# EAGLE design fuzebox (EAGLE 4.13)
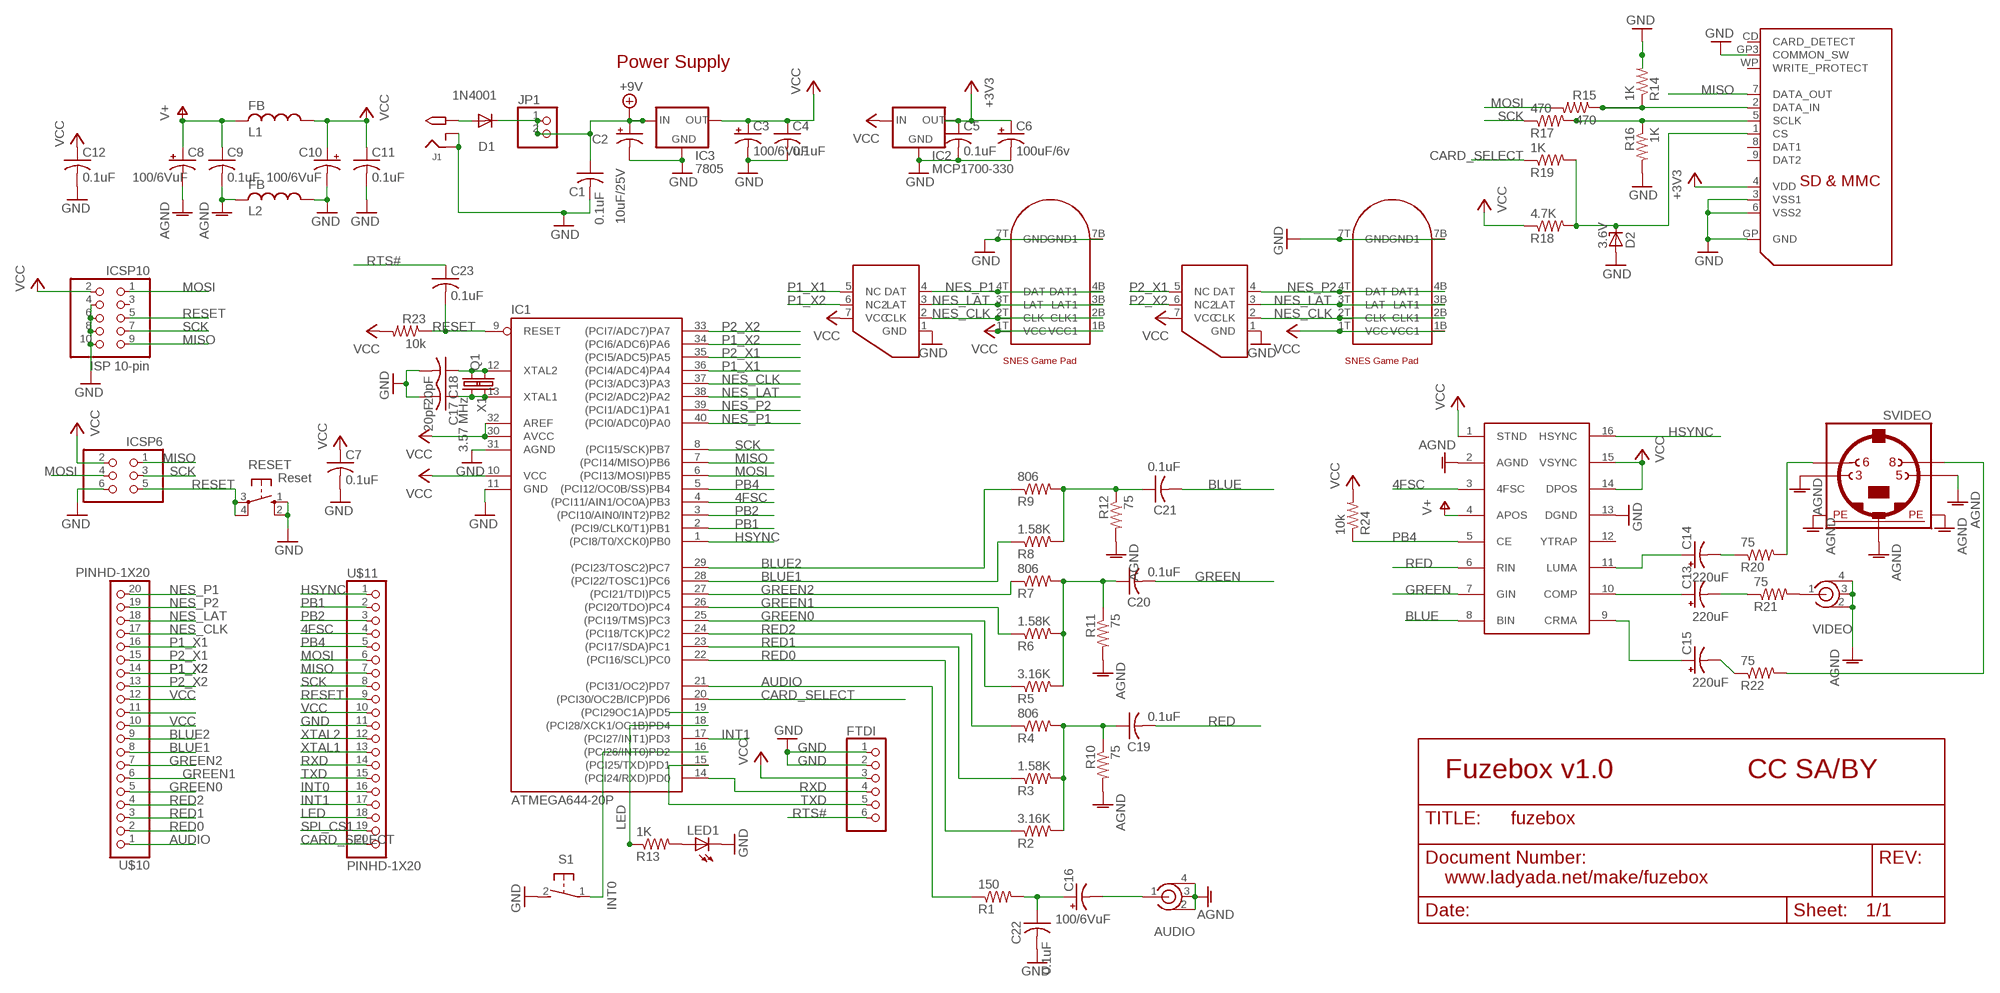
[diagram p0: schematic, sheet 1]

## Parts
AUDIO  RCA-JACK  [RJC-014]
C1  0.1uF  C-US025-025X050  [C025-025X050]
C2  10uF/25V  CPOL-USE2.5-5  [E2,5-5]
C3  100/6VuF  CPOL-USE2.5-6  [E2,5-6]
C4  0.1uF  C-US025-025X050  [C025-025X050]
C5  0.1uF  C-US025-025X050  [C025-025X050]
C6  100uF/6v  CPOL-USE2.5-5  [E2,5-5]
C7  0.1uF  C-US025-025X050  [C025-025X050]
C8  100/6VuF  CPOL-USE2.5-6  [E2,5-6]
C9  0.1uF  C-US025-025X050  [C025-025X050]
C10  100/6VuF  CPOL-USE2.5-5  [E2,5-5]
C11  0.1uF  C-US025-025X050  [C025-025X050]
C12  0.1uF  C-US025-025X050  [C025-025X050]
C13  220uF  CPOL-USE2.5-6  [E2,5-6]
C14  220uF  CPOL-USE2.5-6  [E2,5-6]
C15  220uF  CPOL-USE2.5-6  [E2,5-6]
C16  100/6VuF  CPOL-USE2.5-6  [E2,5-6]
C17  20pF  C-US025-025X050  [C025-025X050]
C18  20pF  C-US025-025X050  [C025-025X050]
C19  0.1uF  C-US025-025X050  [C025-025X050]
C20  0.1uF  C-US025-025X050  [C025-025X050]
C21  0.1uF  C-US025-025X050  [C025-025X050]
C22  0.1uF  C-US025-025X050  [C025-025X050]
C23  0.1uF  C-US025-025X050  [C025-025X050]
D1  1N4001  1N4004  [DO41-10]
D2  3.6V  ZENER-DIODEDO35Z10  [DO35Z10]
FTDI  PINHD-1X6CLEAN  [1X06-CLEAN]
IC1  ATMEGA644-20P  [DIL40]
IC2  MCP1700-330  MC1700  [TO92]
IC3  7805  78XXL  [78XXL]
IC4  AD725  [SO16W]
ICSP6  PINHD-2X3  [2X03]
ICSP10  ISP 10-pin  PINHD-2X5  [2X05]
J1  2.1MMJACK  [PJ-102A]
JP1  PINHD-1X2  [1X02]
L1  FB  [FB]
L2  FB  [FB]
LED1  LED3MM  [LED3MM]
P1  SNES  [SNES]
P1'  NES  [NES]
P2  SNES  [SNES]
P2'  NES  [NES]
Q1  CRYTALTC38H  [TC38H]
R1  150  R-US_0207/10  [0207/10]
R2  3.16K  R-US_0207/5V  [0207/5V]
R3  1.58K  R-US_0207/5V  [0207/5V]
R4  806  R-US_0207/5V  [0207/5V]
R5  3.16K  R-US_0207/5V  [0207/5V]
R6  1.58K  R-US_0207/5V  [0207/5V]
R7  806  R-US_0207/5V  [0207/5V]
R8  1.58K  R-US_0207/5V  [0207/5V]
R9  806  R-US_0207/5V  [0207/5V]
R10  75  R-US_0207/5V  [0207/5V]
R11  75  R-US_0207/5V  [0207/5V]
R12  75  R-US_0207/5V  [0207/5V]
R13  1K  R-US_0207/10  [0207/10]
R14  1K  R-US_0207/10  [0207/10]
R15  470  R-US_0207/10  [0207/10]
R16  1K  R-US_0207/10  [0207/10]
R17  470  R-US_0207/10  [0207/10]
R18  4.7K  R-US_0207/10  [0207/10]
R19  1K  R-US_0207/10  [0207/10]
R20  75  R-US_0207/5V  [0207/5V]
R21  75  R-US_0207/5V  [0207/5V]
R22  75  R-US_0207/5V  [0207/5V]
R23  10k  R-US_0207/10  [0207/10]
R24  10k  R-US_0207/5V  [0207/5V]
RESET  Reset  10-XX  [B3F-10XX]
S1  31-XX  [B3F-31XX]
SVIDEO  MINI_DIN_4  [M_DIN4]
U$10  PINHD-1X20  [1X10-BIG]
U$11  PINHD-1X20  [1X10-BIG]
VIDEO  RCA-JACK  [RJC-014]
X1  3.57 MHz  CRYSTAL  [HC49]
X2  SDMMC06132  [06132]

## Nets
4FSC: IC1.4((PCI11/AIN1/OC0A)PB3) IC4.3(4FSC) U$11.4
+3V3: C5.1 C6.+ IC2.3(OUT) X2.4(VDD)
+9V: C1.1 C2.+ D1.C IC3.IN JP1.1 JP1.2
AGND: AUDIO.2(GND1) AUDIO.3(GND2) AUDIO.4(GND3) C8.- C9.2 IC4.2(AGND) L2.P$2 R10.2 R11.2 R12.2 SVIDEO.3 SVIDEO.5 SVIDEO.SH1(PE1) SVIDEO.SH2(PE2) SVIDEO.SH3(PE3) VIDEO.2(GND1) VIDEO.3(GND2) VIDEO.4(GND3)
AUDIO: IC1.21((PCI31/OC2)PD7) R1.1 U$10.1
BLUE: C21.2 IC4.8(BIN)
BLUE1: IC1.28((PCI22/TOSC1)PC6) R8.1 U$10.8
BLUE2: IC1.29((PCI23/TOSC2)PC7) R9.1 U$10.9
CARD_SELECT: IC1.20((PCI30/OC2B/ICP)PD6) R19.1 U$11.20
GND: C1.2 C2.- C3.- C4.2 C5.2 C6.- C7.2 C10.- C11.2 C12.2 C17.2 C18.2 C22.2 D2.A FTDI.1 FTDI.2 IC1.11(GND) IC1.31(AGND) IC2.1(GND) IC3.GND IC4.13(DGND) ICSP6.6 ICSP10.4 ICSP10.6 ICSP10.8 ICSP10.10 J1.RING J1.RING_SW L2.P$1 LED1.K(C) P1'.1(GND) P1.7B(GND1) P1.7T(GND) P2'.1(GND) P2.7B(GND1) P2.7T(GND) R14.2 R16.2 RESET.1(S) RESET.2(S1) S1.2(S) U$10.11 U$11.11 X2.3(VSS1) X2.6(VSS2) X2.GP3(COMMON_SW) X2.GP(GND)
GREEN: C20.2 IC4.7(GIN)
GREEN0: IC1.25((PCI19/TMS)PC3) R5.1 U$10.5
GREEN1: IC1.26((PCI20/TDO)PC4) R6.1 U$10.6
GREEN2: IC1.27((PCI21/TDI)PC5) R7.1 U$10.7
HSYNC: IC1.1((PCI8/T0/XCK0)PB0) IC4.16(HSYNC) U$11.1
INT0: IC1.16((PCI26/INT0)PD2) S1.1(P) U$11.16
INT1: IC1.17((PCI27/INT1)PD3) U$11.17
LED: IC1.18((PCI28/XCK1/OC1B)PD4) R13.1 U$11.18
MISO: IC1.7((PCI14/MISO)PB6) ICSP6.1 ICSP10.9 U$11.7 X2.7(DATA_OUT)
MOSI: IC1.6((PCI13/MOSI)PB5) ICSP6.4 ICSP10.1 R15.2 U$11.6
N$2: IC1.19((PCI29OC1A)PD5)
N$13: LED1.A R13.2
N$14: C19.1 R2.2 R3.2 R4.2 R10.1
N$16: C20.1 R5.2 R6.2 R7.2 R11.1
N$17: D1.A J1.TIP
N$20: C21.1 R8.2 R9.2 R12.1
N$22: C13.+ IC4.10(COMP)
N$23: C13.- R21.1
N$24: R21.2 VIDEO.1(SIG)
N$26: C16.+ C22.1 R1.2
N$27: AUDIO.1(SIG) C16.-
N$29: R20.2 SVIDEO.6
N$30: R22.2 SVIDEO.8
N$31: C15.- R22.1
N$32: C15.+ IC4.9(CRMA)
N$33: C14.+ IC4.11(LUMA)
N$34: C14.- R20.1
N$46: R14.1 R15.1 X2.2(DATA_IN)
N$47: R16.1 R17.2 X2.5(SCLK)
N$48: D2.C R18.2 R19.2 X2.1(CS)
NES_CLK: IC1.37((PCI3/ADC3)PA3) P1'.2(CLK) P1.2B(CLK1) P1.2T(CLK) P2'.2(CLK) P2.2B(CLK1) P2.2T(CLK) U$10.17
NES_LAT: IC1.38((PCI2/ADC2)PA2) P1'.3(LAT) P1.3B(LAT1) P1.3T(LAT) P2'.3(LAT) P2.3B(LAT1) P2.3T(LAT) U$10.18
NES_P1: IC1.40((PCI0/ADC0)PA0) P1'.4(DAT) P1.4B(DAT1) P1.4T(DAT) U$10.20
NES_P2: IC1.39((PCI1/ADC1)PA1) P2'.4(DAT) P2.4B(DAT1) P2.4T(DAT) U$10.19
P1_X1: IC1.36((PCI4/ADC4)PA4) P1'.5(NC) U$10.16
P1_X2: IC1.34((PCI6/ADC6)PA6) P1'.6(NC2) U$10.14
P2_X1: IC1.35((PCI5/ADC5)PA5) P2'.5(NC) U$10.15
P2_X2: IC1.33((PCI7/ADC7)PA7) P2'.6(NC2) U$10.13
PB1: IC1.2((PCI9/CLK0/T1)PB1) U$11.2
PB2: IC1.3((PCI10/AIN0/INT2)PB2) U$11.3
PB4: IC1.5((PCI12/OC0B/SS)PB4) IC4.5(CE) R24.1 U$11.5
RED: C19.2 IC4.6(RIN)
RED0: IC1.22((PCI16/SCL)PC0) R2.1 U$10.2
RED1: IC1.23((PCI17/SDA)PC1) R3.1 U$10.3
RED2: IC1.24((PCI18/TCK)PC2) R4.1 U$10.4
RESET: C23.2 IC1.9(RESET) ICSP6.5 ICSP10.5 R23.1 RESET.3(P) RESET.4(P1) U$11.9
RTS#: C23.1 FTDI.6
RXD: FTDI.4 IC1.14((PCI24/RXD)PD0) U$11.14
SCK: IC1.8((PCI15/SCK)PB7) ICSP6.3 ICSP10.7 R17.1 U$11.8
SPI_CS1: U$11.19
TXD: FTDI.5 IC1.15((PCI25/TXD)PD1) U$11.15
V+: C8.+ C9.1 IC4.4(APOS) L1.P$2
VCC: C3.+ C4.1 C7.1 C10.+ C11.1 C12.1 FTDI.3 IC1.10(VCC) IC1.30(AVCC) IC1.32(AREF) IC2.2(IN) IC3.OUT IC4.1(STND) IC4.14(DPOS) IC4.15(VSYNC) ICSP6.2 ICSP10.2 L1.P$1 P1'.7(VCC) P1.1B(VCC1) P1.1T(VCC) P2'.7(VCC) P2.1B(VCC1) P2.1T(VCC) R18.1 R23.2 R24.2 U$10.10 U$10.12 U$11.10
XTAL1: C17.1 IC1.13(XTAL1) Q1.1 U$11.13 X1.2
XTAL2: C18.1 IC1.12(XTAL2) Q1.2 U$11.12 X1.1
Unconnected: IC4.12(YTRAP) ICSP10.3 X2.8(DAT1) X2.9(DAT2) X2.CD(CARD_DETECT) X2.WP(WRITE_PROTECT)

## Notes on the sheet
- Power Supply
- Fuzebox v1.0 | CC SA/BY
- www.ladyada.net/make/fuzebox

## Library data of the parts
AUDIO VIDEO = ybox2:RCA-JACK
C1 C4 C7 C9 C11 C12 C19-C23 = minimidi:C-US: CAPACITOR, American symbol
C2 C3 C8 C10 C13-C16 = minimidi:CPOL-US: POLARIZED CAPACITOR, American symbol
C5 C17 C18 = rcl-ez:C-US: CAPACITOR, American symbol
C6 = rcl-ez:CPOL-US: POLARIZED CAPACITOR, American symbol
D1 = minimidi:1N4004: DIODE general purpose rectifier, 1 A
D2 = diode:ZENER-DIODE: Z-Diode
FTDI = carduino:PINHD-1X6: PIN HEADER
IC1 = avr:ATMEGA644*P: MICROCONTROLLER 64 kBytes FLASH 4 kBytes SRAM 2 kBytes EEPROM DUAL USART 8-channel 10 bit ADC
IC2 = ulink:MC1700: VOLTAGE REGULATOR
IC3 = v-reg:78XXL: VOLTAGE REGULATOR
IC4 = ad725:AD725
ICSP6 = pinhead:PINHD-2X3: PIN HEADER
ICSP10 = sonar:PINHD-2X5: PIN HEADER
J1 = minimidi:2.1MMJACK
JP1 = pinhead:PINHD-1X2: PIN HEADER
L1 L2 = ybox2:FB
LED1 = led-ez:LED: LED OSRAM: - CHIPLED LG R971, LG N971, LY N971, LG Q971, LY Q971, LO R971, LY R971 LH N974, LH R974 LS Q976, LO Q976, LY Q976 LO Q996 - Hyper CHIPLED LW Q18S LB Q993, LB Q99A, LB R99A - SideLED LS A670, LO A670, LY A670, LG A670, LP A670 LB A673, LV A673, LT A673, LW A673 LH A674 LY A675 LS A676, LA A676, LO A676, LY A676, LW A676 LS A679, LY A679, LG A679 - Hyper Micro SIDELED® LS Y876, LA Y876, LO Y876, LY Y876 LT Y87S - SmartLED LW L88C, LW L88S LB L89C, LB L89S, LG L890 LS L89K, LO L89K, LY L89K LS L896, LA L896, LO L896, LY L896 - TOPLED LS T670, LO T670, LY T670, LG T670, LP T670 LSG T670, LSP T670, LSY T670, LOP T670, LYG T670 LG T671, LOG T671, LSG T671 LB T673, LV T673, LT T673, LW T673 LH T674 LS T676, LA T676, LO T676, LY T676, LB T676, LH T676, LSB T676, LW T676 LB T67C, LV T67C, LT T67C, LS T67K, LO T67K, LY T67K, LW E67C LS E67B, LA E67B, LO E67B, LY E67B, LB E67C, LV E67C, LT E67C LW T67C LS T679, LY T679, LG T679 LS T770, LO T770, LY T770, LG T770, LP T770 LB T773, LV T773, LT T773, LW T773 LH T774 LS E675, LA E675, LY E675, LS T675 LS T776, LA T776, LO T776, LY T776, LB T776 LHGB T686 LT T68C, LB T68C - Hyper Mini TOPLED® LB M676 - Mini TOPLED Santana® LG M470 LS M47K, LO M47K, LY M47K Source: http://www.osram.convergy.de/
P1 P2 = gameconnectors:SNES
P1' P2' = gameconnectors:NES
Q1 = crystal:CRYTAL: CRYSTAL
R1-R24 = rcl-ez:R-US_: RESISTOR, American symbol
RESET = switch-omron:10-XX: OMRON SWITCH
S1 = switch-omron:31-XX: OMRON SWITCH
SVIDEO = mini_din:MINI_DIN_4
U$10 U$11 = gameconnectors:PINHD-1X20
X1 = sim:CRYSTAL
X2 = ashield:SDMMC

## Board
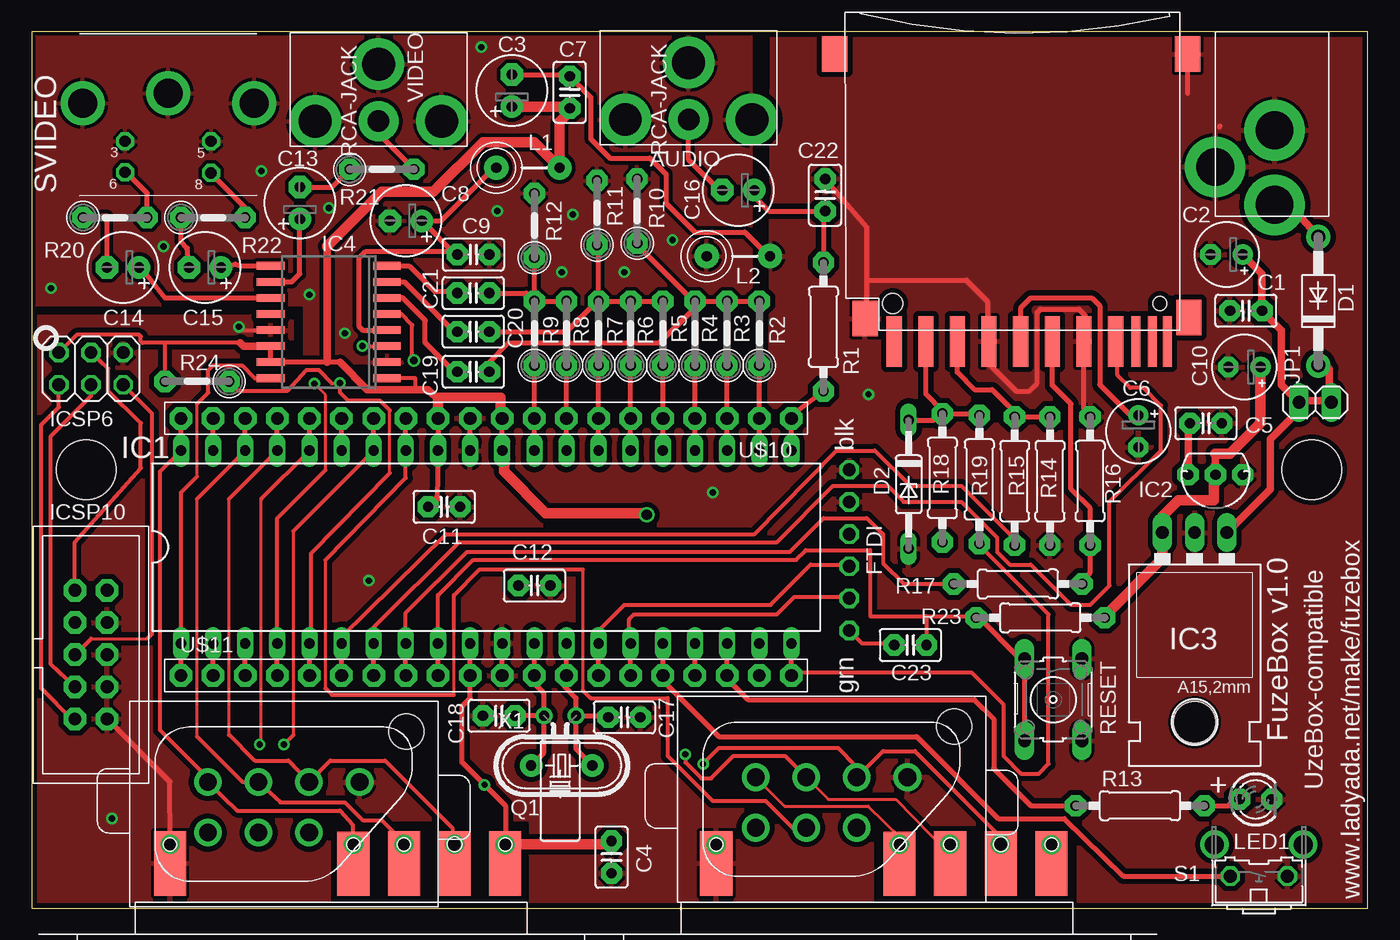
[diagram p1: board, top side]
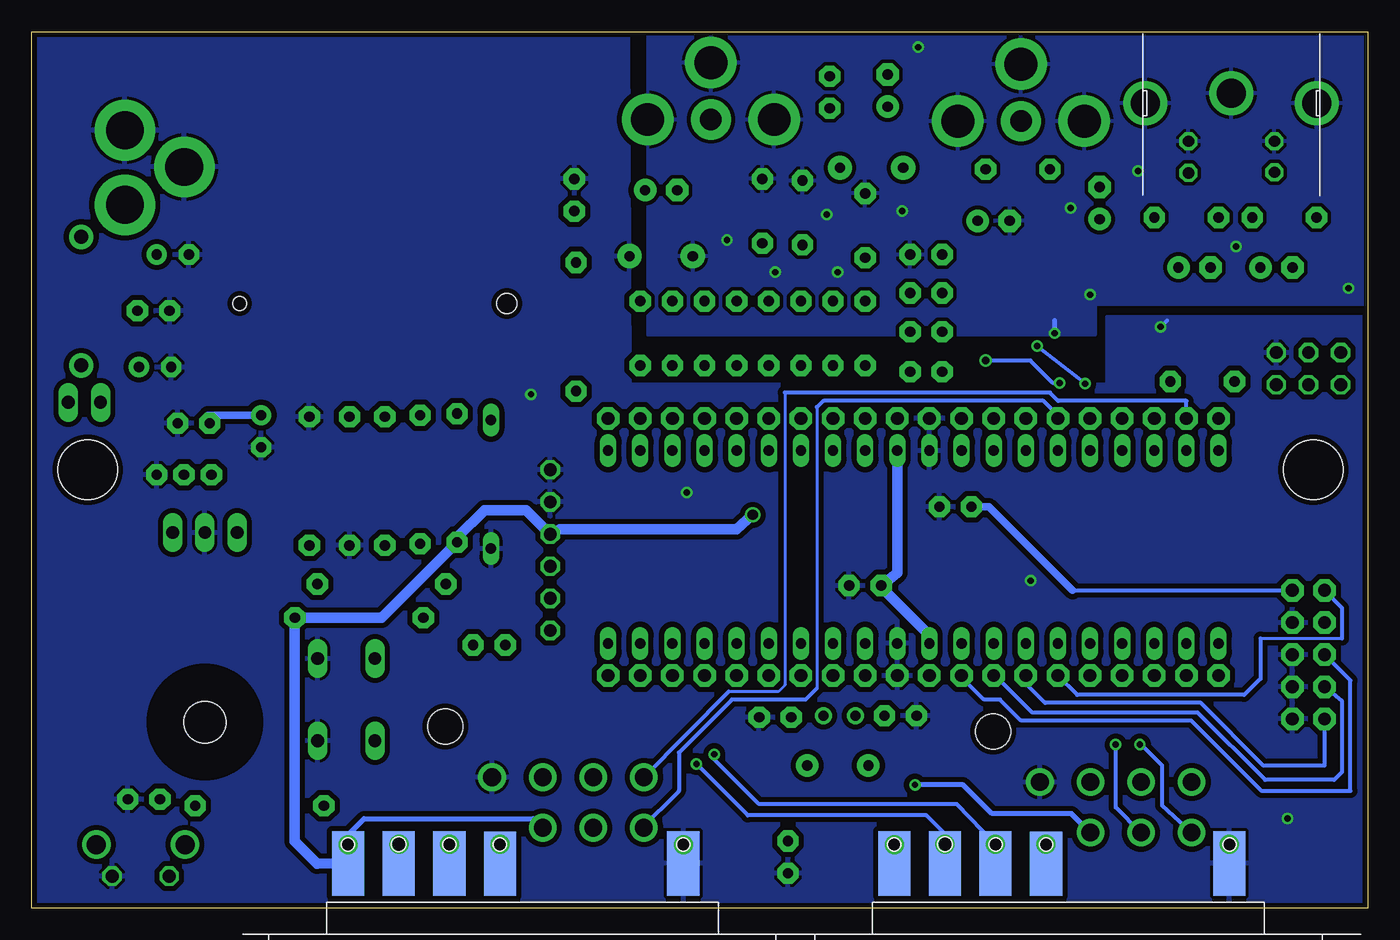
[diagram p2: board, bottom side, seen from below]

Size 105.64 x 69.27 mm. Coordinates in mm from the lower left corner, seen from the top.
Outline: 0,0 105.64,0 105.64,69.27 0,69.27 0,0
Copper layers (1*16): Top 0.035mm / dielectric 1.5mm / Bottom 0.035mm
Design rules "default": minimum track width 10mil, minimum drill 19mil, track to track 10mil, track to pad 10mil, pad to pad 10mil, via to via 10mil, smd to smd 0mil, copper to edge 10mil, drill to drill 8mil, minimum pad ring 10mil, minimum via ring 8mil, stop-mask expansion 4mil, vias tented up to drill 0mil, thermal gap 10mil
Holes 4.7 mm at 4.31,34.63 101.21,34.63

### Footprints (pad centres in the part's own frame; a part is rotated, then mirrored left to right if it is on the bottom)
RJC-014 = drill 1.7 pad 3.175 round: 1 0,0 | drill 2.6 pad 4.064 round: 2 -4.5,0; 3 0,5; 4 0,-5
C025-025X050 = drill 0.813 pad 1.676 octagon: 1 -1.27,0; 2 1.27,0
E2,5-5 = drill 0.813 pad 1.6 round: + -1.27,0 | drill 0.813 pad 1.6 octagon: - 1.27,0
E2,5-6 = drill 0.813 pad 1.778 round: + -1.27,0 | drill 0.813 pad 1.778 octagon: - 1.27,0
DO41-10 = drill 1.118 pad 1.93 round: A 5.08,0; C -5.08,0
DO35Z10 = drill 0.813 long: A 5.08,0; C -5.08,0
1X06-CLEAN = drill 1.016 octagon: 1 -6.35,0; 2 -3.81,0; 3 -1.27,0; 4 1.27,0; 5 3.81,0; 6 6.35,0
DIL40 = drill 0.813 long: 1 -24.13,-7.62; 2 -21.59,-7.62; 3 -19.05,-7.62; 4 -16.51,-7.62; 5 -13.97,-7.62; 6 -11.43,-7.62; 7 -8.89,-7.62; 8 -6.35,-7.62; 9 -3.81,-7.62; 10 -1.27,-7.62; 11 1.27,-7.62; 12 3.81,-7.62; 13 6.35,-7.62; 14 8.89,-7.62; 15 11.43,-7.62; 16 13.97,-7.62; 17 16.51,-7.62; 18 19.05,-7.62; 19 21.59,-7.62; 20 24.13,-7.62; 21 24.13,7.62; 22 21.59,7.62; 23 19.05,7.62; 24 16.51,7.62; 25 13.97,7.62; 26 11.43,7.62; 27 8.89,7.62; 28 6.35,7.62; 29 3.81,7.62; 30 1.27,7.62; 31 -1.27,7.62; 32 -3.81,7.62; 33 -6.35,7.62; 34 -8.89,7.62; 35 -11.43,7.62; 36 -13.97,7.62; 37 -16.51,7.62; 38 -19.05,7.62; 39 -21.59,7.62; 40 -24.13,7.62
TO92 = drill 0.813 pad 1.676 octagon: 1 -2.159,0; 2 0,0; 3 2.159,0
78XXL = drill 1.016 long: GND 0,-3.81; IN -2.54,-3.81; OUT 2.54,-3.81 | hole 3.302: 0,11.176
SO16W = smd 0.6 x 2.2: 1 -4.445,-4.6; 2 -3.175,-4.6; 3 -1.905,-4.6; 4 -0.635,-4.6; 5 0.635,-4.6; 6 1.905,-4.6; 7 3.175,-4.6; 8 4.445,-4.6; 9 4.445,4.6; 10 3.175,4.6; 11 1.905,4.6; 12 0.635,4.6; 13 -0.635,4.6; 14 -1.905,4.6; 15 -3.175,4.6; 16 -4.445,4.6
2X03 = drill 1.016 octagon: 1 -2.54,-1.27; 2 -2.54,1.27; 3 0,-1.27; 4 0,1.27; 5 2.54,-1.27; 6 2.54,1.27
2X05 = drill 1.016 pad 1.778 octagon: 1 -5.08,-1.27; 2 -5.08,1.27; 3 -2.54,-1.27; 4 -2.54,1.27; 5 0,-1.27; 6 0,1.27; 7 2.54,-1.27; 8 2.54,1.27; 9 5.08,-1.27; 10 5.08,1.27
PJ-102A = drill 3 pad 4.8 round: RING 0.1,-3.39; RING_SW -4.6,-6.29; TIP 0.1,-9.29
1X02 = drill 1.016 long: 1 -1.27,0; 2 1.27,0
FB = drill 0.8 pad 1.93 round: P$1 -2.5,0; P$2 2.5,0
LED3MM = drill 0.813 pad 1.676 octagon: A -1.27,0; K 1.27,0
SNES = smd 2.54 x 5.08 bottom: 1B -13.7,5.6; 2B -9.7,5.6; 3B -5.7,5.6; 4B -1.698,5.578; 7B 12.8,5.6 | smd 2.54 x 5.08: 1T -13.7,5.6; 2T -9.7,5.6; 3T -5.7,5.6; 4T -1.698,5.578; 7T 12.8,5.6
NES = drill 1.4 pad 2.184 round: 1 6,2; 2 2,2; 3 -2,2; 4 -6,2; 5 -6,-2; 6 -2,-2; 7 2,-2 | hole 2.8: 9.7,6
TC38H = drill 0.813 round: 1 -1.27,0; 2 1.27,0
0207/10 = drill 0.813 pad 1.676 octagon: 1 -5.08,0; 2 5.08,0
0207/5V = drill 0.813 pad 1.676 octagon: 1 -2.54,0; 2 2.54,0
B3F-10XX = drill 1.016 long: 1 -3.251,2.261; 2 3.251,2.261; 3 -3.251,-2.261; 4 3.251,-2.261
B3F-31XX = drill 1.016 octagon: 1 -2.261,-1.245; 2 2.261,-1.245 | drill 1.499 pad 2.159 round: 3 -3.505,1.245; 4 3.505,1.245
M_DIN4 = drill 0.9 pad 1.422 octagon: 3 -3.4,-3.75; 5 3.4,-3.75; 6 -3.4,-6.2; 8 3.4,-6.25 | drill 2.3 pad 3.5 round: SH1 6.8,-0.75; SH2 0,0.05; SH3 -6.75,-0.75
1X10-BIG = drill 1.016 pad 1.778 octagon: 1 -24.13,0; 2 -21.59,0; 3 -19.05,0; 4 -16.51,0; 5 -13.97,0; 6 -11.43,0; 7 -8.89,0; 8 -6.35,0; 9 -3.81,0; 10 -1.27,0; 11 1.27,0; 12 3.81,0; 13 6.35,0; 14 8.89,0; 15 11.43,0; 16 13.97,0; 17 16.51,0; 18 19.05,0; 19 21.59,0; 20 24.13,0
HC49 = drill 0.813 pad 1.778 round: 1 -2.413,0; 2 2.413,0
06132 = smd 1.2 x 4: 1 6.9,0.9; 2 4.4,0.9; 3 1.9,0.9; 4 -0.6,0.9; 5 -3.1,0.9; 6 -5.6,0.9; 7 -8.1,0.9; 9 9.4,0.9 | smd 0.7 x 4: 8 -9.7,0.9; CD -11,0.9; WP -12.2,0.9 | smd 2 x 2.8: GP -13.8,-21.8; GP2 14.1,-21.8; GP3 11.7,-0.9; GP4 -13.9,-1 | hole 1.1: -11.6,-2.1 | hole 1.6: 9.5,-2.1

### Placement (x,y rotation side)
AUDIO  51.94,62.32 270 top
C1  96.01,47.21 180 top
C2  94.48,51.65 180 top
C3  37.97,64.61 90 top
C4  45.84,4.03 270 top
C5  92.83,38.32 0 top
C6  87.5,37.68 270 top
C7  42.54,64.48 90 top
C8  29.59,54.32 180 top
C9  34.92,51.65 0 top
C10  95.88,42.76 180 top
C11  32.61,31.71 0 top
C12  39.75,25.49 0 top
C13  21.2,55.72 90 top
C14  7.23,50.64 180 top
C15  13.71,50.64 180 top
C16  55.88,56.73 180 top
C17  46.86,15.07 0 top
C18  36.95,15.2 180 top
C19  34.92,42.38 180 top
C20  34.92,45.56 180 top
C21  34.92,48.6 180 top
C22  62.73,56.35 90 top
C23  69.46,20.79 0 top
D1  101.72,47.97 90 top
D2  69.34,33.49 270 top
FTDI  64.64,28.28 270 top
IC1  35.94,28.54 0 top
IC2  93.59,34.25 180 top
IC3  91.94,25.87 180 top
IC4  23.49,46.32 90 top
ICSP6  4.69,42.63 0 top
ICSP10  4.69,20.03 270 top
J1  98.17,64.86 0 top
JP1  101.47,39.97 0 top
L1  39.24,58.51 180 top
L2  55.88,51.52 180 top
LED1  96.77,8.6 0 top
P1  23.74,-2.07 0 bottom
P1'  19.93,7.96 0 top
P2  66.92,-2.07 0 bottom
P2'  63.24,8.34 0 top
Q1  41.78,15.2 180 top
R1  62.61,45.94 90 top
R2  57.53,45.43 90 top
R3  54.99,45.43 90 top
R4  52.45,45.43 90 top
R5  49.91,45.43 90 top
R6  47.37,45.43 90 top
R7  44.83,45.43 90 top
R8  42.29,45.43 90 top
R9  39.75,45.43 90 top
R10  47.87,55.08 90 top
R11  44.7,54.95 90 top
R12  39.75,53.94 90 top
R13  87.62,8.09 0 top
R14  80.51,33.74 270 top
R15  77.72,33.74 270 top
R16  83.69,33.74 90 top
R17  77.97,25.62 0 top
R18  72,34 90 top
R19  74.92,33.87 90 top
R20  6.6,54.57 0 top
R21  27.68,58.38 0 top
R22  14.35,54.57 0 top
R23  79.75,22.95 0 top
R24  13.08,41.62 180 top
RESET  80.77,16.47 270 top
S1  97.02,3.77 0 top
SVIDEO  10.79,64.35 0 top
U$10  35.94,38.7 180 top
U$11  35.94,18.38 0 top
VIDEO  27.43,62.19 270 top
X1  41.91,11.27 0 top
X2  77.59,45.68 180 top

### Tracks (layer width: path | path; a pad name or v marks a point on that pad's centre or on a via)
4FSC  (via drill 0.5)
  Top 0.254: 23.24,34.63 23.24,40.55 v22.35,41.44
  Top 0.305: IC1.4 19.43,30.82 23.24,34.63 | 28.32,44.41 IC4.3 v26.16,44.41
  Top 0.406: U$11.4 IC1.4
  Bottom 0.305: v22.35,41.44 v26.16,44.41
+3V3
  Top 0.406: X2.4 78.19,47.43 78.99,48.22 83.81,48.22 84.45,47.59 84.45,41.36 86.74,39.08 87.5,39.08 C6.+
  Top 0.61: C6.+ 87.62,39.08 | C5.1 91.44,38.32 IC2.3
  Bottom 0.61: C5.1 91.69,38.95 C6.+
+9V
  Top 0.61: 102.61,40.09 JP1.2 | 102.61,40.09 100.2,40.09 JP1.1 100.07,40.22 100.07,40.09 | 100.07,40.09 98.8,41.36 98.8,45.68 C1.1 97.28,50.13 C2.+ | IC3.IN 97.91,33.11 97.91,37.05 100.07,39.21 100.07,40.09 | D1.C 102.61,42.63 102.61,40.09
AGND  (via drill 0.5)
  Bottom 0.406: v24.76,45.43 24.76,46.44
  other vias: 21.97,48.48 1.52,48.98 10.41,52.29 36.83,55.08 42.79,54.83 35.55,68.03 46.86,50.25 50.67,52.79 41.91,50.25 23.49,55.33 18.16,58.26
  pour Bottom (isolate 0.305): -0.89,70.95 -0.89,47.71 21.59,47.71 21.59,45.3 56.89,45.3 56.89,70.83
  pour Top (isolate 0.305): -0.89,70.95 -0.89,47.71 21.59,47.71 21.59,43.14 56.89,43.14 56.89,70.83
AUDIO
  Top 0.406: IC1.21 U$10.1 | U$10.1 60.07,38.82 60.32,38.82 | U$10.1 60.07,38.95 R1.1
BLUE
  Top 0.406: IC4.8 29.84,50.76 31.87,48.73 33.4,48.73 33.52,48.6 C21.2
BLUE1
  Top 0.406: IC1.28 U$10.8 | U$10.8 41.91,38.7 | U$10.8 R8.1
BLUE2
  Top 0.406: 39.87,42.89 R9.1 U$10.9 39.75,36.41 | IC1.29 39.75,36.41 | 39.75,36.41 40,36.41
CARD_SELECT
  Top 0.305: U$11.20 60.19,18.5 60.19,18.63 74.29,18.63 76.83,16.09 76.83,12.03 78.23,10.63 79.62,10.63 80.39,11.39 80.39,23.2 74.92,28.66 R19.1
  Top 0.406: U$11.20 60.07,18.63 60.19,18.76 60.07,18.88 IC1.20
GND  (via drill 0.5, 1)
  Top 0.254: P1.7B v10.94,5.04
  Top 0.305: X2.6 83.18,44.79 83.18,44.54 83.31,44.41 | IC4.13 16.63,45.68 v16.38,45.94
  Top 0.406: C3.- 42.41,65.88 C7.2 44.19,64.1 44.19,60.8 45.72,59.27 48.89,59.27 50.16,58 50.16,55.72 52.45,53.43 56.38,53.43 58.41,51.4 L2.P$1 | U$11.11 IC1.11 | U$10.11 34.79,38.7 34.67,38.57 IC1.31 | 93.91,61.74 93.97,61.81 | 91.39,64.39 X2.GP | R16.2 83.69,38.95 83.19,39.45 X2.6 | X2.3 75.69,43.01 77.85,40.86 78.86,40.86 79.5,41.49 79.5,47.08 79.75,47.33 82.8,47.33 83.31,46.83 | 83.31,44.41 83.31,44.16 | 65.9,46.32 66.03,46.32 66.03,49.62 | C22.2 66.03,53.81 66.03,49.62 | 75.56,44.66 75.56,47.97 73.91,49.62 66.03,49.62 | ICSP10.10 10.92,9.99 v10.94,5.04 10.79,4.03
  Bottom 0.254: v10.94,5.04 10.79,3.9
  Bottom 0.305: v16.38,45.94 15.87,46.44
  other vias: 54.12,5.02 53.84,32.86 26.66,25.87 6.34,7.07 66.16,40.6
  pour Bottom (isolate 0.406): 58.54,69.43 58.41,41.36 20.57,41.36 20.57,46.7 -0.64,46.7 -0.64,40.98 -0.51,-2.2 107.56,-2.32 107.56,69.3
  pour Top (isolate 0.406): 58.54,69.43 58.41,41.36 20.57,41.36 20.57,46.7 -0.64,46.7 -0.64,40.98 -0.51,-2.2 23.49,-2.2 23.49,7.07 39.49,7.07 39.49,-2.07 66.42,-2.07 66.42,6.69 82.8,6.69 82.8,-2.32 107.56,-2.32 107.56,69.3
GREEN
  Top 0.406: IC4.7 29.46,49.49 33.52,45.43 C20.2
GREEN0
  Top 0.406: IC1.25 U$10.5 | U$10.5 49.91,38.95 50.16,38.95 | 49.91,42.76 R5.1 | U$10.5 49.91,42.76 | 49.91,42.76 50.16,42.76
GREEN1
  Top 0.406: 47.37,38.57 U$10.6 R6.1 47.62,42.89 | IC1.26 47.37,38.57 | 47.37,38.57 47.75,38.57
GREEN2
  Top 0.406: IC1.27 U$10.7 | U$10.7 44.83,38.95 45.08,38.95 | 44.83,42.76 R7.1 | U$10.7 44.83,42.76 | 44.83,42.76 44.95,42.76
HSYNC
  Top 0.254: 13.08,34.12 13.08,39.84
  Top 0.305: IC4.16 18.92,41.9 | 13.08,34.12 11.81,32.86 11.81,21.04 | 11.81,20.79 IC1.1 | IC4.16 18.92,41.84 | 13.08,39.84 13.96,40.73 13.96,42.51 14.35,42.89 16.63,42.89 17.65,41.87 IC4.16
  Top 0.406: U$11.1 11.81,20.79 11.81,21.04 IC1.1
INT0
  Top 0.406: IC1.16 U$11.16 49.78,18.38 49.65,18.25 54.35,13.55 69.97,13.55 76.45,7.07 81.66,7.07 86.33,2.53 S1.1
INT1
  Top 0.406: U$11.17 52.45,18.5 52.57,18.63 52.45,18.76 IC1.17
LED
  Top 0.406: IC1.18 54.99,18.63 55.11,18.5 U$11.18 54.86,18.25 56.64,16.47 74.54,16.47 76.07,14.95 76.07,11.01 78.99,8.09 R13.1
MISO
  Top 0.305: IC1.7 27.05,22.19 33.78,28.92 58.92,28.92 63.37,33.36 67.69,33.36 68.96,32.09 73.53,32.09 76.32,29.3 76.32,28.16 77.34,27.14 78.99,27.14 82.16,23.96 83.69,23.96 85.21,25.49 85.21,32.09 89.28,36.16 89.28,39.71 87.88,41.11 86.86,41.11 85.85,42.13 85.85,44.29 85.6,44.53 | 85.6,44.53 85.59,44.54 | ICSP10.9 3.3,14.82 0.76,17.36 0.76,38.19 2.15,39.59 ICSP6.1 2.28,41.36 | X2.7 85.7,44.79 85.72,44.79 85.72,44.64 85.6,44.53
  Top 0.406: U$11.7 IC1.7
  Bottom 0.305: ICSP10.9 3.42,11.27 8.25,11.27 13.2,16.22 25.52,16.22 27.05,17.74 U$11.7 27.05,18.5
MOSI
  Top 0.305: IC1.6 24.51,21.43 32.76,29.55 57.15,29.55 63.62,36.16 66.67,36.16 69.46,33.36 73.53,33.36 77.59,29.3 77.59,28.66 77.72,28.54 R15.2 | ICSP6.4 6.07,42.63 6.07,40.86 8.63,38.32 8.63,34.76 3.42,28.92 ICSP10.1 3.42,24.85
  Top 0.406: U$11.6 IC1.6
  Bottom 0.254: 2.03,21.3 8.5,21.3
  Bottom 0.305: U$11.6 22.98,16.85 9.77,16.85 8.5,18.12 8.5,21.3 | ICSP10.1 2.03,23.71 2.03,21.3
N$13
  Top 0.406: LED1.A 95.37,8.6 95.25,8.72 94.61,8.09 R13.2
N$14
  Top 0.406: R4.2 52.45,47.84 52.32,47.97 | R10.1 47.87,52.41 52.32,47.97 | R3.2 55.11,47.97 | R4.2 R3.2 | R3.2 R2.2 | C19.1 36.19,43.14 37.71,44.67 49.65,44.67 52.32,47.33 52.32,47.97 | 52.32,47.97 R4.2
N$16
  Top 0.406: R7.2 44.7,47.97 42.29,45.56 C20.1 | R7.2 R6.2 R5.2 | R7.2 44.83,52.29 R11.1
N$17
  Top 0.61: J1.TIP 99.45,55.57 D1.A
N$20
  Top 0.406: R9.2 R12.1 | R8.2 42.16,47.97 42.03,47.84 41.91,47.97 R9.2 | C21.1 39.11,48.6 R9.2
N$22
  Top 0.406: IC4.10 20.57,49.49 21.2,50.13 21.2,54.19 21.33,54.32 C13.+
N$23
  Top 0.406: 25.27,58.51 R21.1 23.74,56.99 C13.-
N$24
  Top 0.406: VIDEO.1 27.43,61.18 R21.2
N$26
  Top 0.406: R1.2 62.61,54.45 62.48,55.08 C22.1 58.29,55.08 57.27,56.1 C16.+
N$27
  Top 0.406: C16.- 54.6,56.48 51.94,59.14 AUDIO.1
N$29
  Top 0.406: SVIDEO.6 7.46,58.15 9.14,56.48 R20.2
N$30
  Top 0.406: R22.2 16.89,55.33 14.19,58.03 SVIDEO.8
N$31
  Top 0.406: C15.- 12.31,52.16 11.81,52.67 R22.1
N$32
  Top 0.406: C15.+ 16.12,50.89 16.5,50.76 IC4.9
N$33
  Top 0.406: C14.+ 8.63,50.64 10.54,48.22 IC4.11
N$34
  Top 0.406: C14.- 5.96,54.7 R20.1
N$46
  Top 0.406: X2.2 73.19,42.34 74.54,40.98 75.94,40.98 77.59,39.33 77.59,39.08 77.72,38.95 R15.1 80.26,38.82 80.39,38.95 R14.1
N$47
  Top 0.406: X2.5 80.69,41.31 82.16,39.84 82.16,33.11 83.69,31.59 83.69,28.92 83.81,28.79 R16.1 83.69,26.5 83.05,25.87 R17.2
N$48
  Top 0.406: R18.2 72.13,39.21 70.69,40.64 X2.1 | R18.2 71.88,39.08 71.37,38.57 D2.C | R19.2 74.8,38.95 74.67,39.08 R18.2
NES_CLK  (via drill 0.5, 1)
  Top 0.254: 15.62,13.68 15.62,32.35
  Top 0.305: v76.6,5.04 76.6,5.65 69.84,12.41 67.31,12.41 P2'.2 65.15,9.99 65.15,11.27 63.75,12.66 54.35,12.66 v53.08,11.39 | 15.62,32.35 IC1.37 | P1'.2 21.97,10.63 | P1'.2 23.62,11.65 27.93,11.65 33.27,6.31 33.27,3.65 P1.2B v33.42,5.04 | 15.62,13.68 17.65,11.65 20.32,11.65 P1'.2 | v76.6,5.04 P2.2B v76.6,5.04
  Top 0.406: 19.43,38.82 U$10.17 IC1.37
  Bottom 0.305: P1.2B v33.42,5.04 33.14,5.55 34.92,7.33 49.02,7.33 v53.08,11.39 | v76.6,5.04 P2.2B
NES_LAT  (via drill 0.5, 1)
  Top 0.254: P2'.3 62.99,8.6 68.32,8.6 72.39,4.41 | 13.08,13.55 13.08,32.35 | v29.43,5.04 P1.3B 29.33,3.65 29.46,3.77
  Top 0.305: P1'.3 19.68,8.34 24.76,8.34 26.16,6.95 27.68,6.95 29.46,5.17 29.43,5.14 v29.43,5.04 | 29.2,5.93 29.2,3.77 29.33,3.65 | 13.08,32.35 IC1.38 | P1'.3 18.03,9.87 | 13.08,13.55 16.63,9.99 P1'.3 | 72.51,3.39 v72.61,5.04 | 72.51,3.39 P2.3B | 72.39,4.41 72.39,3.52 72.51,3.39 | v51.68,12.15 51.68,11.52 52.95,10.25 53.72,10.25 55.49,12.03 59.56,12.03 P2'.3
  Top 0.406: IC1.38 U$10.18
  Bottom 0.254: P1.3B 29.2,3.52 29.33,3.39 v29.43,5.04
  Bottom 0.305: v72.61,5.04 P2.3B | v29.43,5.04 32.51,8.22 48.13,8.22 51.68,11.77 v51.68,12.15
NES_P1  (via drill 1)
  Top 0.305: IC1.40 10.15,34.51 10.15,14.06 14.22,9.99 P1'.4 16.25,7.71 24.38,7.71 25.39,6.57 25.39,3.65 P1.4B v25.45,5.04
  Top 0.406: 11.81,38.82 U$10.20 IC1.40
  Bottom 0.305: v25.45,5.04 P1.4B
NES_P2  (via drill 1)
  Top 0.254: P2'.4 59.53,8.06 66.14,8.06 68.7,5.55
  Top 0.305: 68.7,5.3 68.7,5.55 P2.4B v68.6,5.04
  Top 0.406: 14.35,38.57 U$10.19 | IC1.39 14.35,38.57 | 14.35,38.57 14.47,38.57
  Bottom 0.254: 46.1,40.73 46.1,17.61 46.6,17.11 50.54,17.11
  Bottom 0.305: 69.72,5.8 69.72,4.53 P2.4B v68.6,5.04 | 57.78,9.87 P2'.4 50.54,17.11 | 14.35,38.57 U$10.19 14.35,40.09 24.51,40.09 25.14,40.73 46.1,40.73
P1_X1  (via drill 0.5)
  Top 0.254: 18.16,13.04 18.16,32.35
  Top 0.305: 18.16,32.35 IC1.36 | v18.03,12.92 18.16,13.04
  Top 0.406: 21.97,38.82 U$10.16 IC1.36
  Bottom 0.305: v18.03,12.92 17.9,12.92 16.25,11.27 16.25,8.09 P1'.5
P1_X2  (via drill 0.5)
  Top 0.254: 20.7,13.68 20.7,29.81
  Top 0.305: 20.7,29.81 IC1.34 | v19.93,12.92 20.7,13.68
  Top 0.406: IC1.34 U$10.14
  Bottom 0.305: v19.93,12.92 19.93,7.96 P1'.6
P2_X1
  Top 0.406: IC1.35 U$10.15
  Bottom 0.254: 43.56,39.59 43.56,17.36
  Bottom 0.305: 43.56,17.36 44.45,16.47 50.29,16.47 54.48,12.28 54.48,9.23 57.53,6.18 P2'.5 | 43.56,39.59 43.05,40.09 25.65,40.09 24.51,38.95
  Bottom 0.406: U$10.15 24.51,38.95
P2_X2
  Top 0.254: 23.24,17.36 23.24,27.52 | 33.4,16.85 33.4,21.93 | 43.56,26.76 43.56,17.23
  Top 0.305: 23.24,27.52 29.59,34 IC1.33 | 23.24,17.36 23.74,16.85 33.4,16.85 | 33.4,21.93 33.4,24.73 35.43,26.76 43.56,26.76 | 43.56,17.23 44.19,16.6 50.29,16.6 50.29,12.03 53.84,8.47 58.03,8.47 60.19,6.31 P2'.6
  Top 0.406: U$10.13 29.46,38.7 29.59,38.57 IC1.33
PB1
  Top 0.406: IC1.2 14.47,20.92 14.35,20.79 U$11.2
PB2
  Top 0.406: 16.89,21.04 IC1.3 | U$11.3 16.89,21.04 | 16.89,21.04 16.76,21.17
PB4  (via drill 0.5, 0.6)
  Top 0.254: 28.32,34.38 28.32,39.33 | v24.38,41.49 24.35,41.47 24.33,41.47 24.33,41.44 23.74,41.44
  Top 0.305: 22.09,20.92 22.09,28.03 28.32,34.38 | IC4.5 29.2,46.95 30.09,46.06 30.09,43.4 v30.22,43.27 | v24.38,41.49 24.38,40.73 25.01,40.09 27.55,40.09 28.32,39.33 | R24.1 16.38,40.86 20.19,40.86 21.71,42.51 22.73,42.51 23.74,41.44
  Top 0.406: IC1.5 22.09,20.92 21.97,20.79 U$11.5
  Bottom 0.305: v30.22,43.27 26.66,43.27 24.89,41.49 v24.38,41.49
RED
  Top 0.406: IC4.6 29.33,48.22 31.11,46.44 31.11,44.67 33.4,42.38 C19.2
RED0
  Top 0.406: U$10.2 57.53,38.95 | IC1.22 U$10.2 | U$10.2 R2.1 57.78,42.89
RED1
  Top 0.406: IC1.23 U$10.3 | U$10.3 54.99,38.82 54.86,38.82 | U$10.3 R3.1 54.86,42.89
RED2
  Top 0.406: IC1.24 U$10.4 | U$10.4 52.45,38.82 52.19,38.82 | 52.45,43.14 R4.1 | U$10.4 52.45,43.14 | 52.45,43.14 52.19,43.14
RESET
  Top 0.254: 4.69,21.3 9.14,21.3
  Top 0.305: 74.42,23.2 R23.1 74.67,23.08 70.73,23.08 | IC1.9 32.13,24.73 34.92,27.52 60.45,27.52 61.21,28.28 66.29,28.28 66.29,23.08 70.73,23.08 | ICSP6.5 9.52,39.08 9.52,21.68 9.14,21.3 | ICSP10.5 4.69,21.3 | 70.73,23.08 C23.2
  Top 0.406: RESET.4 78.51,13.27 78.48,13.3 78.51,13.32 RESET.3 78.15,19.72 74.8,23.08 R23.1 | U$11.9 IC1.9
  Bottom 0.305: ICSP10.5 1.39,18 1.39,9.23 8.38,9.23 13.96,14.82 27.43,14.82 29.08,16.47 30.35,16.47 32.13,18.25 U$11.9
RTS#
  Top 0.305: C23.1 68.19,20.92 65.65,20.92 FTDI.6
RXD
  Top 0.305: IC1.14 44.83,21.93 46.86,23.96 58.41,23.96 61.59,27.14 64.38,27.14 64.51,27.01 FTDI.4
  Top 0.406: 44.83,18.25 U$11.14 IC1.14
SCK
  Top 0.305: 29.71,20.92 29.59,21.04 29.59,23.33 34.41,28.16 59.94,28.16 62.61,30.82 66.03,30.82 67.31,29.55 67.31,27.27 68.96,25.62 R17.1 73.15,25.62 | ICSP10.7 1.52,19.27 1.52,37.3 4.69,40.48 ICSP6.3 4.69,41.49
  Top 0.406: IC1.8 29.71,20.92 29.59,20.79 U$11.8
  Bottom 0.305: ICSP10.7 2.03,16.34 2.03,10.76 2.66,10.12 8.12,10.12 13.46,15.46 26.54,15.46 29.46,18.38 U$11.8
TXD
  Top 0.305: FTDI.5 64.51,24.6 60.32,24.6 58.92,23.2 47.62,23.2 47.24,22.82 47.24,21.04 IC1.15
  Top 0.406: U$11.15 IC1.15
V+
  Top 0.406: 33.52,51.65 C8.+ 32.38,54.32 36.74,58.68 | IC4.4 26.16,45.68 25.9,45.94 25.9,51.4 26.41,51.91 33.27,51.91 33.52,51.65 | 33.52,51.65 C9.1 | 36.74,58.68 36.83,58.76 | 36.74,58.68 L1.P$2
VCC  (via drill 0.5, 0.8, 1)
  Top 0.254: v37.44,5.02 P1.1B 36.95,3.65 37.08,3.77 37.08,4.79
  Top 0.305: 46.1,5.04 C4.1 | 37.08,4.79 37.33,5.04 | ICSP6.2 3.55,45.3 8.5,45.3 8.63,45.17 8.63,44.79 8.76,44.67 10.54,44.67 | 16.5,44.67 10.54,44.67 | v80.61,5.02 P2.1B | 10.54,44.67 R24.2 | IC4.1 30.35,41.87 30.35,40.98
  Top 0.406: 42.29,62.95 C7.1 42.67,63.08 | IC4.14 18.79,44.41 18.89,44.31 IC4.15 23.36,43.14 24.38,43.14 | 34.79,21.04 IC1.10 U$11.10 34.67,16.6 34.03,15.96 34.03,11.52 v35.81,9.74 37.46,8.09 37.46,5.04 v37.44,5.02 | 37.33,38.57 U$10.10 37.08,38.7 | 37.21,38.44 IC1.30 37.33,36.28 | IC4.1 28.19,41.87 | 32.13,38.82 U$10.12 31.87,38.7 32.13,38.44 IC1.32 32.08,32.4
  Top 0.61: IC3.OUT 89.4,30.95 | IC2.2 93.59,35.14 | 93.59,34.89 IC2.2 | IC2.2 93.59,35.9 | 97.28,42.76 97.15,43.14 C10.+ | 23.36,43.14 23.36,52.29 | R23.2 84.83,23.08 | 16.5,44.67 16.76,44.41 18.79,44.41 | 32.08,32.4 C11.1 | 32.13,40.09 32.25,40.09 31.36,40.98 30.35,40.98 26.54,40.98 24.38,43.14
  Top 0.813: C3.+ 41.91,63.34 42.29,62.95 | 42.67,63.08 41.74,62.15 L1.P$1 39.71,60.54 35.68,60.54 31.75,56.6 27.68,56.6 23.36,52.29 | 89.4,30.95 90.67,32.22 93.47,32.22 93.47,34.25 93.59,34.89 | 93.59,35.9 94.74,35.9 97.15,38.32 97.15,42.38 97.28,42.76 | 37.21,38.44 37.33,38.57 | IC3.OUT 89.4,27.65 84.83,23.08 | 37.33,5.04 46.1,5.04 | 32.13,38.82 32.13,40.09 32.13,40.35 37.08,40.35 37.08,38.7 | U$11.10 35.05,18.38 | 37.33,36.28 37.33,34.51 40.63,31.2 48.51,31.2 v48.64,31.08
  Bottom 0.254: 36.95,3.65 P1.1B v37.44,5.02
  Bottom 0.305: 23.36,25.11 ICSP10.2 | P2.1B v80.61,5.02
  Bottom 0.406: P1'.7 23.43,7.46 29.71,7.46 32,9.74 v35.81,9.74 | P2'.7 65.97,7.07 79.37,7.07 80.51,5.93 80.51,5.04 80.59,5.04 v80.61,5.02
  Bottom 0.61: IC1.10 34.79,20.92 34.79,21.68 | 72,29.3 R18.1 | 31.36,31.71 C11.1 29.97,31.71 23.36,25.11
  Bottom 0.813: P2.1B 83.05,3.52 84.83,5.3 R23.2 77.97,22.95 R18.1 | 72,29.3 69.84,31.46 66.54,31.46 FTDI.3 63.88,29.93 49.91,29.93 v48.64,31.08 | 34.79,21.68 38.48,25.36 C12.1 37.21,26.5 IC1.30 37.21,36.28
XTAL1
  Top 0.406: IC1.13 42.16,20.92 42.29,20.79 U$11.13 42.29,18.25 42.16,18.12 42.16,17.49 43.05,16.6 Q1.1 | 45.72,15.07 C17.1 45.46,15.07 46.22,15.2 Q1.1 | X1.2 43.05,12.54 Q1.1
XTAL2
  Top 0.406: 40,21.17 IC1.12 U$11.12 39.62,18.25 39.62,17.87 40.51,16.98 Q1.2 | Q1.2 40.51,15.33 40.38,15.2 C18.1 | X1.1 40.51,12.28 Q1.2

### Text on the board
tPlace: blk | grn | FuzeBox v1.0 | + | UzeBox-compatible | www.ladyada.net/make/fuzebox